# Altium schematic sheet MUX.SchDoc: Multiplekser interfejsu SWD
size A4; Organization: Altium Limited; Address1: L3, 12a Rodborough Rd; Adress2: Frenchs Forest; Address3: NSW; Address4: Australia 2086; SheetNumber: 6
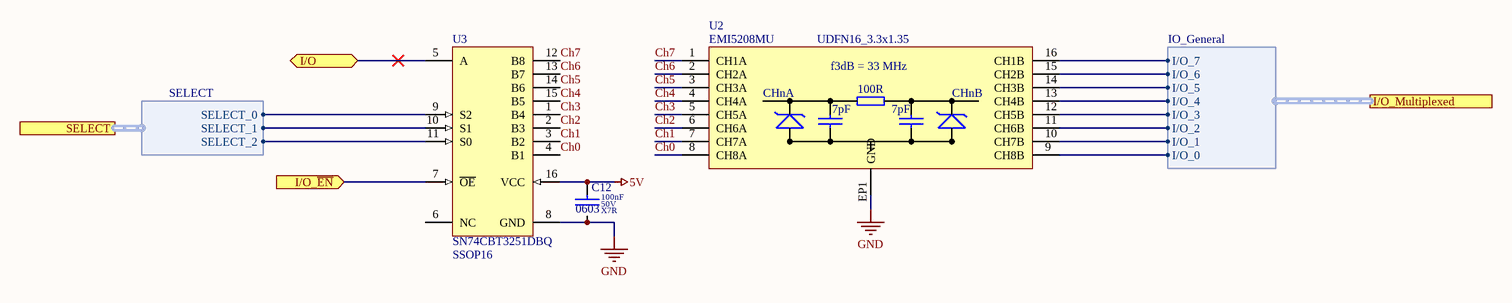
[diagram p0: MUX.SchDoc]

## Parts
C12  value 100nF  Dielectric: X7R  Voltage: 50V  SCH_Footprint: 0603  [C_0603_1608]  (hidden comment: Ceramic X7R)
U2  value EMI5208MU  [UDFN16_3.3x1.35]  (hidden comment: 8- channel ESD protector 5V + Lo-pas filter)
U3  value SN74CBT3251DBQ  SCH_Footprint: SSOP16  [SSOP16_4.9x3.9]  (hidden comment: 1-of-8 FET Multiplexer and Demultiplexer)

## Ports
I/O (bidir), I/O_Multiplexed (harness IO_General), I/O_~{EN} (in), SELECT (harness SELECT)

## Harnesses
IO_General: I/O_0, I/O_1, I/O_2, I/O_3, I/O_5, I/O_6, I/O_7, I/O_4
SELECT: SELECT_0, SELECT_1, SELECT_2

## Nets
5V: C12.1 U3.16(VCC)
GND: C12.2 U2.EP1(GND) U3.8(GND)
Ch0: U2.8(CH8A) U3.4(B1)
Ch1: U2.7(CH7A) U3.3(B2)
Ch2: U2.6(CH6A) U3.2(B3)
Ch3: U2.5(CH5A) U3.1(B4)
Ch4: U2.4(CH4A) U3.15(B5)
Ch5: U2.3(CH3A) U3.14(B6)
Ch6: U2.2(CH2A) U3.13(B7)
Ch7: U2.1(CH1A) U3.12(B8)
I/O: U3.5(A) ; port I/O
I/O_~{EN}: U3.7(~{OE}) ; port I/O_~{EN}
NetU2_9: U2.9(CH8B) ; port I/O_Multiplexed.I/O_0
NetU2_10: U2.10(CH7B) ; port I/O_Multiplexed.I/O_1
NetU2_11: U2.11(CH6B) ; port I/O_Multiplexed.I/O_2
NetU2_12: U2.12(CH5B) ; port I/O_Multiplexed.I/O_3
NetU2_13: U2.13(CH4B) ; port I/O_Multiplexed.I/O_4
NetU2_14: U2.14(CH3B) ; port I/O_Multiplexed.I/O_5
NetU2_15: U2.15(CH2B) ; port I/O_Multiplexed.I/O_6
NetU2_16: U2.16(CH1B) ; port I/O_Multiplexed.I/O_7
NetU3_9: U3.9(S2) ; port SELECT.SELECT_0
NetU3_10: U3.10(S1) ; port SELECT.SELECT_1
NetU3_11: U3.11(S0) ; port SELECT.SELECT_2

Not connected (* = marked no-connect by the designer): U3 6(NC)

## Notes on the sheet
- Elektronika i Telekomunikacja
- Akademia Górniczo Hutnicza im stanisława Staszica w Krakowie
- Filip Świątek
- (in symbol U_EMI5208MU) f3dB = 33 MHz; 100R; CHnA; CHnB; 7pF

## Library data of the parts
C12 = C_100nF_50V_X7R_0603_5: Capacitor; Manufacturer: Samsung; Manufacturer Part Number: CL10B104JB8NNNC; Tolerance (%): 5; Part Number: C_100nF_50V_X7R_0603_5; HelpURL: http://www.tme.eu/pl/Document/4a42202b32dab16128fe107dd69598cc/samsung-chip-cap.pdf; Supplier 1: TME; Supplier Part Number 1: CL10B104JB8NNNC; Supplier 2: RS Components; Supplier 3: Farnell; Supplier 4: Mouser; Supplier 5: Digi-Key
U2 = U_EMI5208MU: 8 - channel esd-protection + lo-pass filter; Manufacturer: ON Semiconductor; SCH_Footprint: UDFN16_3.3x1.35; Part Number: U_EMI5208MU; HelpURL: https://www.onsemi.com/pub/Collateral/EMI5204MU-D.PDF; Manufacturer Part Number: EMI5208MU; Supplier 1: TME; Supplier 2: RS Components; Supplier 3: Farnell; Supplier Part Number 3: 2844908; Supplier 4: Mouser; Supplier Part Number 4: 863-EMI5208MUTAG; Supplier 5: Digi-Key; Supplier Part Number 5: EMI5208MUTAGOSCT-ND
U3 = U_SN74CBT3251DBQ: Manufacturer: Texas Instruments; Part Number: U_SN74CBT3251DBQ; HelpURL: http://www.ti.com/lit/gpn/sn74cbt3251; Manufacturer Part Number: SN74CBT3251DBQ; Supplier 1: TME; Supplier 2: RS Components; Supplier 3: Farnell; Supplier 4: Mouser; Supplier Part Number 4: 595-SN74CBT3251DBQR; Supplier 5: Digi-Key; Supplier Part Number 5: 296-6429-2-ND